# Altium project Secondary_Flight_Storage.PrjPcb
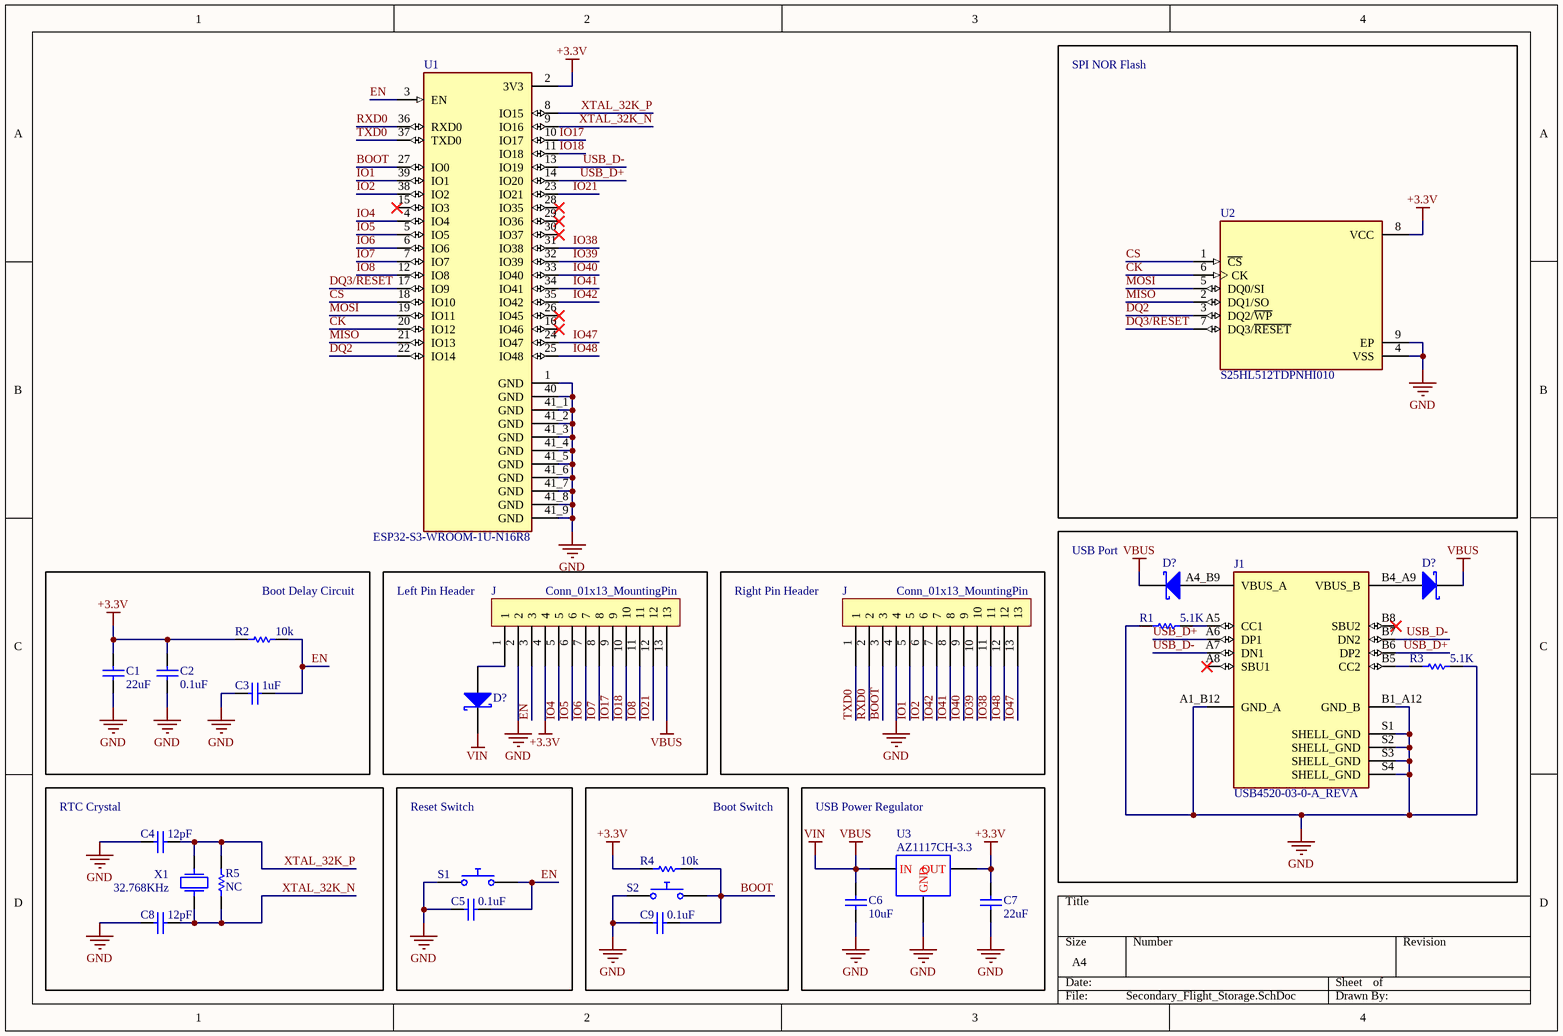
[diagram p0: Secondary_Flight_Storage.SchDoc]
1 sheet, 26 parts. Net scope: global (net labels, ports and power ports of the same name join across sheets).

## Sheet Secondary_Flight_Storage.SchDoc
size A4; SheetNumber: 1; SheetTotal: 1

### Parts
(Parts that share a designator on the sheet are numbered #1, #2 ... from top to bottom, then left to right.)
C1  value 22uF  (hidden comment: Capacitor)
C2  value 0.1uF  (hidden comment: Capacitor)
C3  value 1uF  (hidden comment: Capacitor)
C4  value 12pF  (hidden comment: Capacitor)
C5  value 0.1uF  (hidden comment: Capacitor)
C6  value 10uF  (hidden comment: Capacitor)
C7  value 22uF  (hidden comment: Capacitor)
C8  value 12pF  (hidden comment: Capacitor)
C9  value 0.1uF  (hidden comment: Capacitor)
D?#1  Schottky Diode  (value not drawn)
D?#2  Schottky Diode  (value not drawn)
D?#3  Schottky Diode  (value not drawn)
J1  USB4520-03-0-A_REVA  [GCT_USB4520-03-0-A_REVA]
J#1  Conn_01x13_MountingPin
J#2  Conn_01x13_MountingPin
R1  value 5.1K  (hidden comment: Resistor)
R2  value 10k  (hidden comment: Resistor)
R3  value 5.1K  (hidden comment: Resistor)
R4  value 10k  (hidden comment: Resistor)
R5  value NC  (hidden comment: Resistor)
S1  Push Button Normally Opened  (value not drawn)
S2  Push Button Normally Opened  (value not drawn)
U1  ESP32-S3-WROOM-1U-N16R8  [XCVR_ESP32-S3-WROOM-1U-N16R8]
U2  S25HL512TDPNHI010  [SON127P600X800X80-9N]
U3  AZ1117CH-3.3
X1  F0: 32.768KHz  (hidden comment: Crystal)

### Blocks framed on the sheet
SPI NOR Flash: U2
USB Port: D?#1 D?#2 J1 R1 R3
Boot Delay Circuit: C1-C3 R2
Left Pin Header: D?#3 J#1
Right Pin Header: J#2
RTC Crystal: C4 C8 R5 X1
Reset Switch: C5 S1
Boot Switch: C9 R4 S2
USB Power Regulator: C6 C7 U3

### Nets
+3.3V: C1.2 C2.2 C7.1 J#1.4 R2.1 R4.1 U1.2(3V3) U2.8(VCC) U3.3(OUT)
GND: C1.1 C2.1 C3.2 C4.2 C5.2 C6.2 C7.2 C8.2 C9.2 J1.A1_B12(GND_A) J1.B1_A12(GND_B) J1.S1(SHELL_GND) J1.S2(SHELL_GND) J1.S3(SHELL_GND) J1.S4(SHELL_GND) J#1.2 J#2.4 R1.1 R3.2 S1.1 S2.1 U1.1(GND) U1.40(GND) U1.41_1(GND) U1.41_2(GND) U1.41_3(GND) U1.41_4(GND) U1.41_5(GND) U1.41_6(GND) U1.41_7(GND) U1.41_8(GND) U1.41_9(GND) U2.4(VSS) U2.9(EP) U3.2(GND)
VBUS: C6.1 D?#1.2(K) D?#2.2(K) D?#3.2(K) J#1.13 U3.1(IN)  [also labelled VIN]
BOOT: C9.1 J#2.3 R4.2 S2.2 U1.27(IO0)
CK: U1.20(IO12) U2.6(CK)
CS: U1.18(IO10) U2.1(~{CS})
DQ2: U1.22(IO14) U2.3(DQ2/~{WP})
DQ3/RESET: U1.17(IO9) U2.7(DQ3/~{RESET})
EN: C3.1 C5.1 J#1.3 R2.2 S1.2 U1.3(EN)
IO1: J#2.5 U1.39(IO1)
IO2: J#2.6 U1.38(IO2)
IO4: J#1.5 U1.4(IO4)
IO5: J#1.6 U1.5(IO5)
IO6: J#1.7 U1.6(IO6)
IO7: J#1.8 U1.7(IO7)
IO8: J#1.11 U1.12(IO8)
IO17: J#1.9 U1.10(IO17)
IO18: J#1.10 U1.11(IO18)
IO21: J#1.12 U1.23(IO21)
IO38: J#2.11 U1.31(IO38)
IO39: J#2.10 U1.32(IO39)
IO40: J#2.9 U1.33(IO40)
IO41: J#2.8 U1.34(IO41)
IO42: J#2.7 U1.35(IO42)
IO47: J#2.13 U1.24(IO47)
IO48: J#2.12 U1.25(IO48)
MISO: U1.21(IO13) U2.2(DQ1/SO)
MOSI: U1.19(IO11) U2.5(DQ0/SI)
RXD0: J#2.2 U1.36(RXD0)
TXD0: J#2.1 U1.37(TXD0)
USB_D+: J1.A6(DP1) J1.B6(DP2) U1.14(IO20)
USB_D-: J1.A7(DN1) J1.B7(DN2) U1.13(IO19)
XTAL_32K_N: C8.1 R5.1 U1.9(IO16) X1.1
XTAL_32K_P: C4.1 R5.2 U1.8(IO15) X1.2
NetD?#1_1: D?#1.1(A) J1.A4_B9(VBUS_A)
NetD?#2_1: D?#2.1(A) J1.B4_A9(VBUS_B)
NetD?#3_1: D?#3.1(A) J#1.1
NetJ1_A5: J1.A5(CC1) R1.2
NetJ1_B5: J1.B5(CC2) R3.1

Not connected (* = marked no-connect by the designer): J1 A8(SBU1)* B8(SBU2)*; U1 15(IO3)* 16(IO46)* 26(IO45)* 28(IO35)* 29(IO36)* 30(IO37)*

### Library data of the parts
C1-C9 = Capacitor: SimulationGenericComponent: True
D?#1-D?#3 = Schottky Diode: AF: 1; BV: 0; BV_MAX: 1e99; EG: 1.11; FC: 0.5; IBV: 0.001; IS: 1e-14; MJSW: 0.33; NTUN: 30; TNOM: 27; XTI: 3; SimulationGenericComponent: True; CJO: 0; CJP: 0; CTA: 0; CTP: 0; FCS: 0.5; FV_MAX: 1e99; IKF: 0; IKR: 0; ISR: 1e-14; JSW: 0; JTUN: 0; JTUNSW: 0; KEG: 1; KF: 0; LEVEL: 1; N: 1; NBV: 1; NR: 1; NS: 1; PHP: 1; RS: 0; TCV: 0; TLEV: 0; TLEVC: 0; TM1: 0; TM2: 0; TPB: 0; TPHP: 0; TRS: 0; TRS2: 0; TT: 0; TTT1: 0; TTT2: 0; VJ: 1; XTITUN: 3
J1 = USB4520-03-0-A_REVA: USB-C (USB TYPE-C) USB 2.0 Receptacle Connector 24 (16+8 Dummy) Position Board Edge, Cutout; Surface Mount; Through Hole, Right Angle; MF: Global Connector Technology; SnapEDA_Link: https://www.snapeda.com/parts/USB4520-03-0-A/Global+Connector+Technology/view-part/?ref=snap; Package: None; Value: *; MP: USB4520-03-0-A; Check_prices: https://www.snapeda.com/parts/USB4520-03-0-A/Global+Connector+Technology/view-part/?ref=eda
R1-R5 = Resistor: TC1: 0; SimulationGenericComponent: True; TC2: 0
S1 S2 = Push Button NO: closed: 0; Rclosed: 1m; Ropen: 1Meg; SimulationGenericComponent: True
U1 = ESP32-S3-WROOM-1U-N16R8: Bluetooth, WiFi 802.11b/g/n, Bluetooth v5.0 Transceiver Module 2.4GHz Antenna Not Included, U.FL Surface Mount; MF: Espressif Systems; Package: None; Price: None; Value: *; SnapEDA_Link: https://www.snapeda.com/parts/ESP32-S3-WROOM-1U-N16R8/Espressif+Systems/view-part/?ref=snap; MP: ESP32-S3-WROOM-1U-N16R8; Availability: Unavailable; Check_prices: https://www.snapeda.com/parts/ESP32-S3-WROOM-1U-N16R8/Espressif+Systems/view-part/?ref=eda
U2 = S25HL512TDPNHI010: NOR Flash Serial (SPI, Dual SPI, Quad SPI) 3V/3.3V 512M-bit 64M x 8 8-Pin WSON EP Tray; MF: Infineon Technologies; SnapEDA_Link: https://www.snapeda.com/parts/S25HL512TDPNHI010/Infineon/view-part/?ref=snap; Package: None; Value: *; MP: S25HL512TDPNHI010; Check_prices: https://www.snapeda.com/parts/S25HL512TDPNHI010/Infineon/view-part/?ref=eda
U3 = Linear Voltage Regulator (Fixed): Positive Fixed Voltage regulator; Av_feedback: 1665; R1_Value: 1020; SimulationGenericComponent: True
X1 = Crystal: R: 500; Q: 50K; SimulationGenericComponent: True